# Altium schematic sheet MCU.SchDoc
size B; SheetNumber: 1; SheetTotal: 1
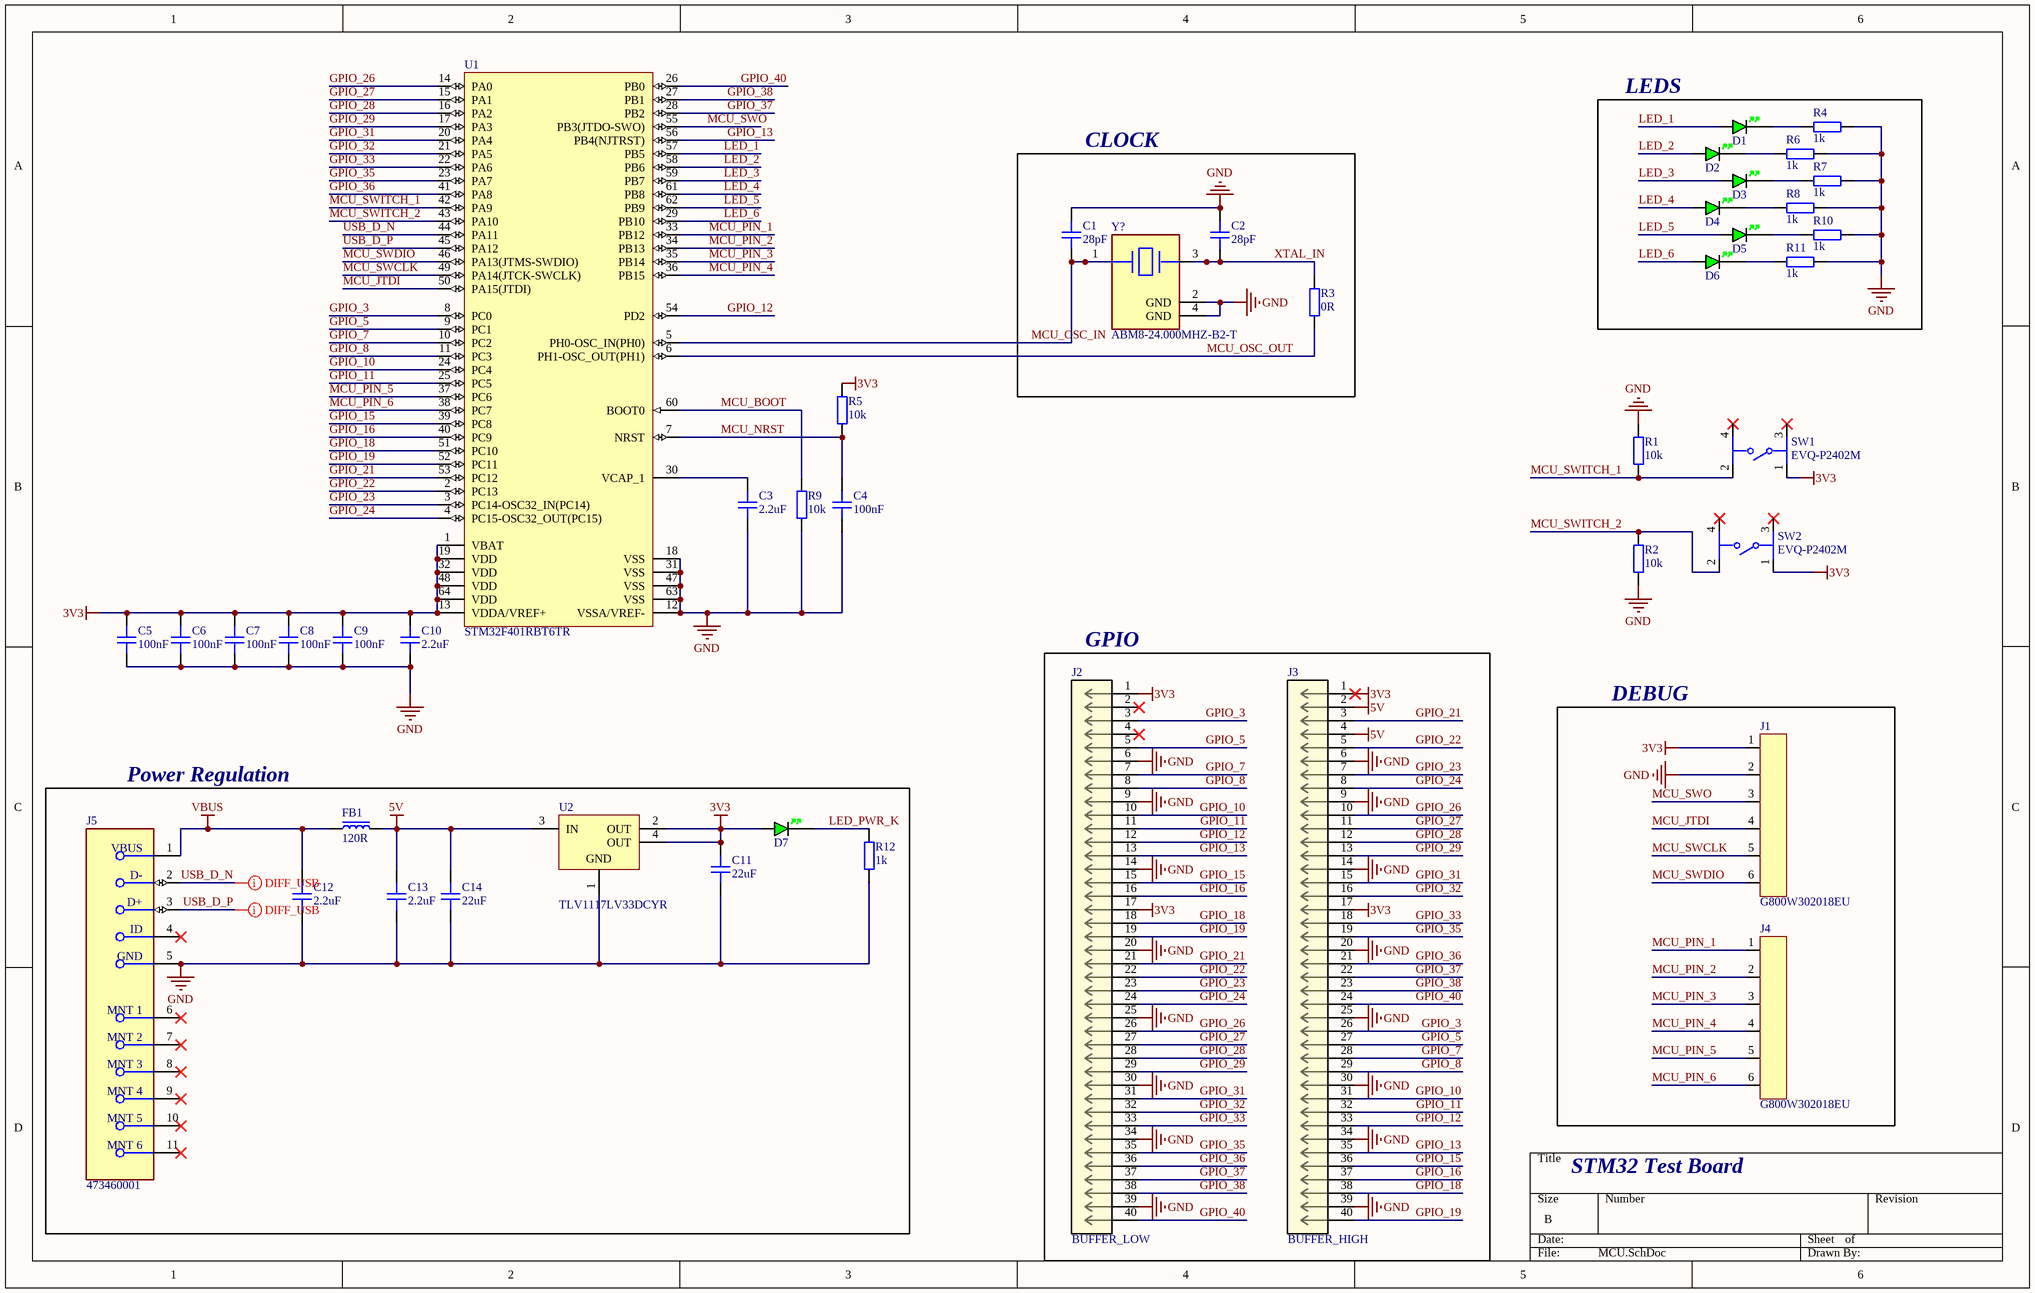
[diagram p0: MCU.SchDoc]

## Parts
C1  28pF  [CAP_0603]
C2  28pF  [CAP_0603]
C3  2.2uF  [CAP_0805]
C4  100nF  [CAP_0805]
C5  100nF  [CAP_0805]
C6  100nF  [CAP_0805]
C7  100nF  [CAP_0805]
C8  100nF  [CAP_0805]
C9  100nF  [CAP_0805]
C10  2.2uF  [CAP_0805]
C11  22uF  [CAP_0805]
C12  2.2uF  [CAP_0805]
C13  2.2uF  [CAP_0805]
C14  22uF  [CAP_0805]
D1  GREEN  [LED_0805_GREEN]  (value not drawn)
D2  GREEN  [LED_0805_GREEN]  (value not drawn)
D3  GREEN  [LED_0805_GREEN]  (value not drawn)
D4  GREEN  [LED_0805_GREEN]  (value not drawn)
D5  GREEN  [LED_0805_GREEN]  (value not drawn)
D6  GREEN  [LED_0805_GREEN]  (value not drawn)
D7  GREEN  [LED_0805_GREEN]  (value not drawn)
FB1  120R  [FB_0805]
J1  G800W302018EU  [G800W302018EU]
J2  BUFFER_LOW  [CONN_3020-40-0100-00_CNC]
J3  BUFFER_HIGH  [CONN_3020-40-0100-00_CNC]
J4  G800W302018EU  [G800W302018EU]
J5  473460001  [FP-473460001-MFG]
R1  10k  [RES_0805]
R2  10k  [RES_0805]
R3  0R  [RES_0805]
R4  1k  [RES_0805]
R5  10k  [RES_0805]
R6  1k  [RES_0805]
R7  1k  [RES_0805]
R8  1k  [RES_0805]
R9  10k  [RES_0805]
R10  1k  [RES_0805]
R11  1k  [RES_0805]
R12  1k  [RES_0805]
SW1  EVQ-P2402M  [FP-EVQ-P2402M-MFG]
SW2  EVQ-P2402M  [FP-EVQ-P2402M-MFG]
U1  STM32F401RBT6TR  [STM-LQFP64_L]
U2  TLV1117LV33DCYR  [DCY0004A_N]
Y?  ABM8-24.000MHZ-B2-T  [FP-ABM8-MFG]

## Blocks framed on the sheet
LEDS: D1-D6 R4 R6-R8 R10 R11
CLOCK: C1 C2 R3 Y?
GPIO: J2 J3
DEBUG: J1 J4
Power Regulation: C11-C14 D7 FB1 J5 R12 U2

## Nets
3V3: C5.2 C6.2 C7.2 C8.2 C9.2 C10.2 C11.2 D7.A J1.1 J2.1 J2.17 J3.1 J3.17 R5.2 SW1.1 SW2.1 U1.1(VBAT) U1.13(VDDA/VREF+) U1.19(VDD) U1.32(VDD) U1.48(VDD) U1.64(VDD) U2.2(OUT) U2.4(OUT)
5V: C13.2 C14.2 FB1.2 J3.2 J3.4 U2.3(IN)
GND: C1.2 C2.2 C3.1 C4.1 C5.1 C6.1 C7.1 C8.1 C9.1 C10.1 C11.1 C12.1 C13.1 C14.1 J1.2 J2.6 J2.9 J2.14 J2.20 J2.25 J2.30 J2.34 J2.39 J3.6 J3.9 J3.14 J3.20 J3.25 J3.30 J3.34 J3.39 J5.5(GND) R1.1 R2.1 R4.1 R6.1 R7.1 R8.1 R9.1 R10.1 R11.1 R12.1 U1.12(VSSA/VREF-) U1.18(VSS) U1.31(VSS) U1.47(VSS) U1.63(VSS) U2.1(GND) Y?.2(GND) Y?.4(GND)
VBUS: C12.2 FB1.1 J5.1(VBUS)
GPIO_3: J2.3 J3.26 U1.8(PC0)
GPIO_5: J2.5 J3.27 U1.9(PC1)
GPIO_7: J2.7 J3.28 U1.10(PC2)
GPIO_8: J2.8 J3.29 U1.11(PC3)
GPIO_10: J2.10 J3.31 U1.24(PC4)
GPIO_11: J2.11 J3.32 U1.25(PC5)
GPIO_12: J2.12 J3.33 U1.54(PD2)
GPIO_13: J2.13 J3.35 U1.56(PB4(NJTRST))
GPIO_15: J2.15 J3.36 U1.39(PC8)
GPIO_16: J2.16 J3.37 U1.40(PC9)
GPIO_18: J2.18 J3.38 U1.51(PC10)
GPIO_19: J2.19 J3.40 U1.52(PC11)
GPIO_21: J2.21 J3.3 U1.53(PC12)
GPIO_22: J2.22 J3.5 U1.2(PC13)
GPIO_23: J2.23 J3.7 U1.3(PC14-OSC32_IN(PC14))
GPIO_24: J2.24 J3.8 U1.4(PC15-OSC32_OUT(PC15))
GPIO_26: J2.26 J3.10 U1.14(PA0)
GPIO_27: J2.27 J3.11 U1.15(PA1)
GPIO_28: J2.28 J3.12 U1.16(PA2)
GPIO_29: J2.29 J3.13 U1.17(PA3)
GPIO_31: J2.31 J3.15 U1.20(PA4)
GPIO_32: J2.32 J3.16 U1.21(PA5)
GPIO_33: J2.33 J3.18 U1.22(PA6)
GPIO_35: J2.35 J3.19 U1.23(PA7)
GPIO_36: J2.36 J3.21 U1.41(PA8)
GPIO_37: J2.37 J3.22 U1.28(PB2)
GPIO_38: J2.38 J3.23 U1.27(PB1)
GPIO_40: J2.40 J3.24 U1.26(PB0)
LED_1: D1.A U1.57(PB5)
LED_2: D2.A U1.58(PB6)
LED_3: D3.A U1.59(PB7)
LED_4: D4.A U1.61(PB8)
LED_5: D5.A U1.62(PB9)
LED_6: D6.A U1.29(PB10)
LED_PWR_K: D7.K R12.2
MCU_BOOT: R9.2 U1.60(BOOT0)
MCU_JTDI: J1.4 U1.50(PA15(JTDI))
MCU_NRST: C4.2 R5.1 U1.7(NRST)
MCU_OSC_IN: C1.1 U1.5(PH0-OSC_IN(PH0)) Y?.1
MCU_OSC_OUT: R3.1 U1.6(PH1-OSC_OUT(PH1))
MCU_PIN_1: J4.1 U1.33(PB12)
MCU_PIN_2: J4.2 U1.34(PB13)
MCU_PIN_3: J4.3 U1.35(PB14)
MCU_PIN_4: J4.4 U1.36(PB15)
MCU_PIN_5: J4.5 U1.37(PC6)
MCU_PIN_6: J4.6 U1.38(PC7)
MCU_SWCLK: J1.5 U1.49(PA14(JTCK-SWCLK))
MCU_SWDIO: J1.6 U1.46(PA13(JTMS-SWDIO))
MCU_SWITCH_1: R1.2 SW1.2 U1.42(PA9)
MCU_SWITCH_2: R2.2 SW2.2 U1.43(PA10)
MCU_SWO: J1.3 U1.55(PB3(JTDO-SWO))
USB_D_N: J5.2(D-) U1.44(PA11)
USB_D_P: J5.3(D+) U1.45(PA12)
XTAL_IN: C2.1 R3.2 Y?.3
NetC3_2: C3.2 U1.30(VCAP_1)
NetD1_K: D1.K R4.2
NetD2_K: D2.K R6.2
NetD3_K: D3.K R7.2
NetD4_K: D4.K R8.2
NetD5_K: D5.K R10.2
NetD6_K: D6.K R11.2

Not connected (* = marked no-connect by the designer): J2 2* 4*; J5 4(ID)* 6(MNT_1)* 7(MNT_2)* 8(MNT_3)* 9(MNT_4)* 10(MNT_5)* 11(MNT_6)*; SW1 3* 4*; SW2 3* 4*

## Layout directives
differential pair: USB_D_N, USB_D_P

## Notes on the sheet
- STM32 Test Board

## Library data of the parts
C1 C2 = CAP_0603_16V: Capacitor SMD 0603 16V
C3-C14 = CAP_0805_16V: Capacitor SMD 0805 16V
D1-D7 = LED_0805_GREEN: LED 0805 GREEN SMD; Manufacturer: *; Manufacturer Part Number: *; Distributor Link: *; LCSC: *
FB1 = FB_0805: Ferrite Bead SMD 0805; Manufacturer: *; Manufacturer Part Number: *; Distributor Link: *; LCSC: *
J1 J4 = G800W302018EU: Pin Header 6 Position 2.54mm Pitch; Manufacturer: Amphenol; Manufacturer Part Number: G800W302018EU
J2 J3 = 3020-40-0100-00: No Description Available; Mfr_Name: CNC Tech; RefDes: RefDes; Type: Type
J5 = CMP-2000-05246-2: CONN RCPT USB2.0 MICRO B SMD R/A; Manufacturer: Molex; Conn Orientation: Right Angle; Is Female: yes; Shielding: true; Pitch: 0.65mm; Number Of Contacts: 5; Voltage Rating: 30V; Current Rating: 1.8A; Device Class L2: USB Connectors; Digikey Description: CONN RCPT USB2.0 MICRO B SMD R/A; Height: 2.945mm; RoHS: TRUE; ComponentLink2Description: Datasheet; Octopart: https://octopart.com/47346-0001-molex-7164928; Automotive: No; Package: 0; Category: Conn; Device Class L1: Connectors; Usb Standard: USB 2.0; Temperature: -30°C to +85°C; Temperature Range Low: -30°C; Footprint Url: https://www.molex.com/pdm_docs/sd/473460001_sd.pdf; ComponentLink2URL: https://www.molex.com/webdocs/datasheets/pdf/en-us/0473460001_IO_CONNECTORS.pdf; Lead Free: Yes; Manufacturer Part Number: 473460001; Contact Material: Gold,Nickel; Temperature Range High: +85°C; Device Class L3: unset
R1-R12 = RES_0805: Resistor SMD 0805; Manufacturer: *; Manufacturer Part Number: *; Distributor Link: *
SW1 SW2 = CMP-05618-000087-1: SWITCH TACTILE SPST-NO 0.02A 15V; Mechanical Life: 500000Cycles; Contact Resistance: 100mR; Max Current Rating: 20mA; Throw Configuration: SPST; Switch Function: Off-Mom; Illumination Type: Non-Illuminated; Actuator Color: Natural; Operating Force: 2.4N; Actuator Length: 0.45mm; Switch Travel: 0.25mm; Color: Clear; Size: 3.5mm; Radiation Hardening: No; Mount: Surface Mount; Package Quantity: 1; Length: 3.5mm; Height: 2.1mm; Series: EVQP2; Contact Current Rating: 20mA; Termination: J-Bend; Electrical Life: 500000Cycles; Packaging: Tape and Reel; Current Rating: 20mA; Max Operating Temperature: 85°C; Orientation: Straight; Width: 3.5mm; Max Voltage Rating (DC): 15V; RoHS Compliant: Yes; REACH SVHC: No SVHC; Min Operating Temperature: -40°C; Depth: 5.5mm; Voltage Rating (DC): 15V; Lead Free: Lead Free
U1 = CMP-0243-00143-1: ARM Cortex-M4 32-bit MCU+FPU, 128 KB Flash, 64 KB Internal RAM, 50 I/Os, 64-Pin LQFP, -40 to 85 degC, Tape and Reel; Operating Frequency(F) (Processor speed) (MHz): 84; I/Os (High Current): 50; Supply Voltage(Vcc) min (V): 1.7; Internal RAM Size (kB): 64; FLASH Size (Prog) (kB): 128; Package Description: LQFP64; Packing: Tape and Reel; Mounting Technology: Surface Mount; ComponentLink1URL: http://www.st.com/; ComponentLink1Description: Manufacturer URL; Core: ARM Cortex-M4; ComponentLink2Description: Datasheet; Package Reference: 64-Pin Low-profile Quad Flat Package, Body 10 x 10 mm, Pitch 0.5 mm; DatasheetVersion: Rev. 5; ComponentLink2URL: http://www.st.com/st-web-ui/static/active/en/resource/technical/document/datasheet/DM00086815.pdf
U2 = CMP-0395-00503-2: Single Output LDO, 1 A, Fixed 3.3 V Output, 2 to 5.5 V Input, 4-pin SOT-223 (DCY), -40 to 125 degC, Green (RoHS & no Sb/Br); Manufacturer: Texas Instruments; Vout Adj(Min)(V): 3.3; Vdo(Typ)(mV): 1200; Iq(Typ)(mA): 0.05; Accuracy(%): 2; Iout(Max)(A): 1; SubFamily: Single Channel LDO; Vin(Max)(V): 5.5; PackageReference: DCY0004A; PackageDescription: 4-Pin Plastic Small Outline, Body 3.5 x 6.5 mm, Pitch 2.3 mm; Vout Adj(Max)(V): 3.3; Mounting Technology: Surface Mount; ComponentLink2Description: Datasheet; ComponentLink1Description: Manufacturer URL; PartNumber: TLV1117LV33DCYR; ComponentLink3Description: Package Specification; ComponentLink1URL: http://www.ti.com/; ComponentLink2URL: http://www.ti.com/general/docs/lit/getliterature.tsp?genericPartNumber=TLV1117LV33&fileType=pdf; Fixed Output Options(V): 3.3; PackageVersion: 4202506/B; Vin(Min)(V): 2; DatasheetVersion: SBVS160A; Eco-Plan: Green (RoHS & no Sb/Br); ComponentLink3URL: http://www.ti.com/litv/pdf/mpds094a; Code_JEDEC: TO-261
Y? = CMP-27762-000036-1: Crystal 24MHz ±20ppm 18pF SMD-4 3.2mm x 2.5mm; ESR (Equivalent Series Resistance): 50R; Frequency Stability: 50ppm; Min Operating Temperature: -20°C; Width: 2.5mm; Series Resistance: 50R; Frequency Tolerance: 20ppm; Tolerance: 20ppm; Load Capacitance: 18pF; Mount: Surface Mount; Height: 0.031inch; RoHS Compliant: Yes; Frequency: 24MHz; Radiation Hardening: No; Packaging: Tape and Reel; Lead Free: Lead Free; Resistor Type: Ceramic; Series: ABM8; Termination: SMD/SMT; Length: 3.2mm; Max Operating Temperature: 70°C; Case/Package: CSMD; Package Quantity: 1000; Depth: 2.5mm; Number of Pins: 4; Operating Frequency: 24 MHz; Accuracy: 20ppm; REACH SVHC: No SVHC